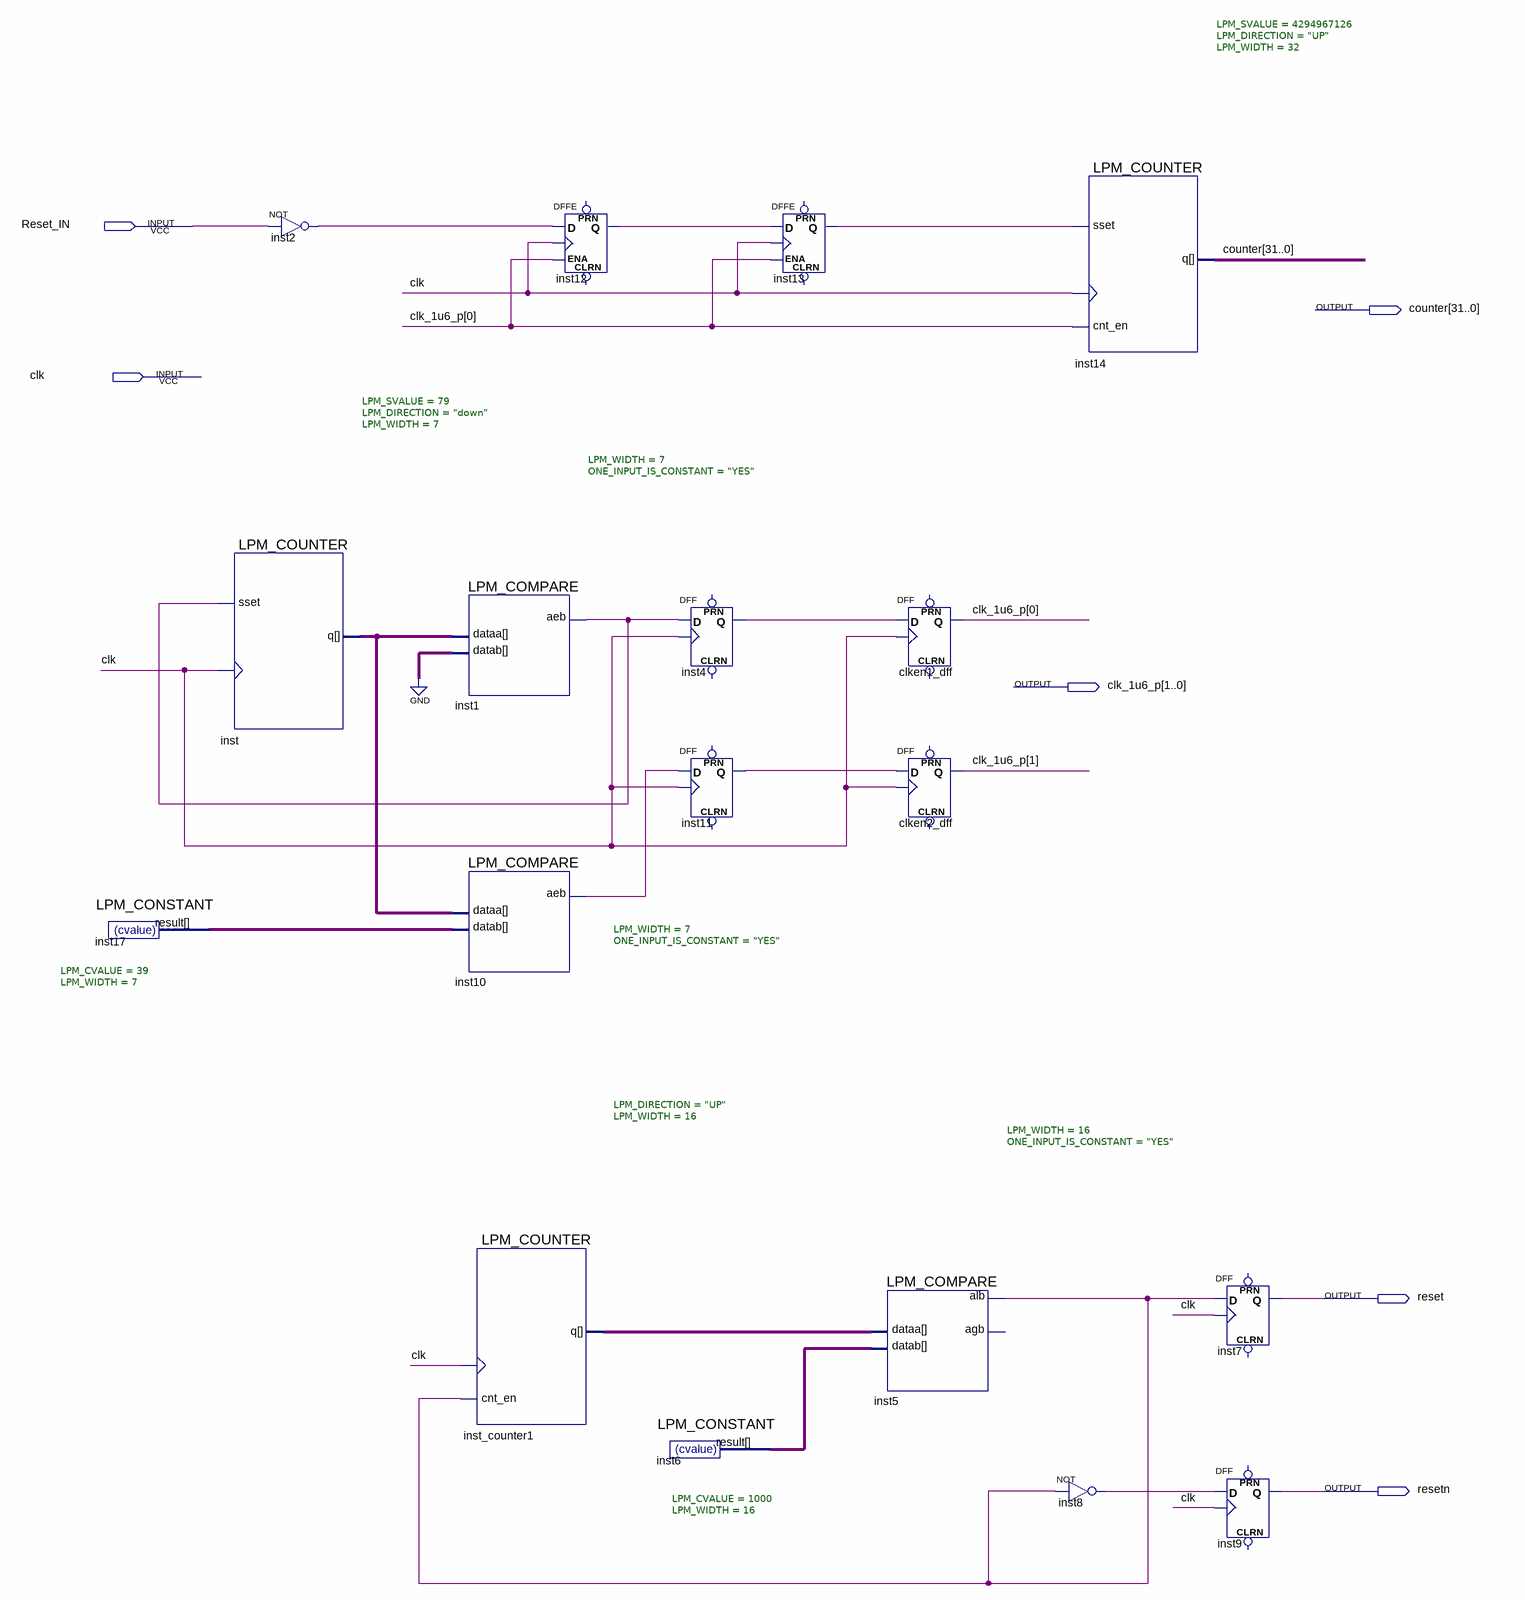
[diagram p0: schematic sheet]
// Quartus schematic CLK_generation.bdf as structural Verilog: 18 symbols, 6 pins
module CLK_generation (
  input  Reset_IN,
  input  clk,
  output [31:0] counter,
  output [1:0] clk_1u6_p,
  output reset,
  output resetn
);

  wire inst1_aeb, inst2_out, inst4_q, inst5_alb, inst8_out, inst10_aeb, inst11_q, inst12_q, inst13_q;
  wire [6:0] inst17_result, inst_q;
  wire [15:0] inst6_result, inst_counter1_q;

  LPM_CONSTANT #(.LPM_CVALUE(39), .LPM_WIDTH(7)) inst17 (.result(inst17_result));
  LPM_COUNTER #(.LPM_SVALUE(79), .LPM_DIRECTION("down"), .LPM_WIDTH(7)) inst (
    .clock(clk), .sset(inst1_aeb), .q(inst_q));
  not inst2 (inst2_out, Reset_IN);
  LPM_COMPARE #(.LPM_WIDTH(7), .ONE_INPUT_IS_CONSTANT("YES")) inst1 (
    .dataa(inst_q), .datab({7{1'b0}}), .aeb(inst1_aeb));
  LPM_COMPARE #(.LPM_WIDTH(7), .ONE_INPUT_IS_CONSTANT("YES")) inst10 (
    .dataa(inst_q), .datab(inst17_result), .aeb(inst10_aeb));
  LPM_COUNTER #(.LPM_DIRECTION("UP"), .LPM_WIDTH(16)) inst_counter1 (
    .clock(clk), .cnt_en(inst5_alb), .q(inst_counter1_q));
  DFFE inst12 (.D(inst2_out), .CLK(clk), .ENA(clk_1u6_p[0]), .Q(inst12_q));  // open: PRN, CLRN
  DFF inst4 (.CLK(clk), .D(inst1_aeb), .Q(inst4_q));  // open: CLRN, PRN
  DFF inst11 (.CLK(clk), .D(inst10_aeb), .Q(inst11_q));  // open: CLRN, PRN
  LPM_CONSTANT #(.LPM_CVALUE(1000), .LPM_WIDTH(16)) inst6 (.result(inst6_result));
  DFFE inst13 (.D(inst12_q), .CLK(clk), .ENA(clk_1u6_p[0]), .Q(inst13_q));  // open: PRN, CLRN
  LPM_COMPARE #(.LPM_WIDTH(16), .ONE_INPUT_IS_CONSTANT("YES")) inst5 (
    .dataa(inst_counter1_q), .datab(inst6_result), .alb(inst5_alb));  // open: agb
  DFF clken1_dff (.CLK(clk), .D(inst4_q), .Q(clk_1u6_p[0]));  // open: CLRN, PRN
  DFF clken2_dff (.CLK(clk), .D(inst11_q), .Q(clk_1u6_p[1]));  // open: CLRN, PRN
  LPM_COUNTER #(.LPM_SVALUE(4294967126), .LPM_DIRECTION("UP"), .LPM_WIDTH(32)) inst14 (
    .clock(clk), .cnt_en(clk_1u6_p[0]), .sset(inst13_q), .q(counter));
  not inst8 (inst8_out, inst5_alb);
  DFF inst7 (.CLK(clk), .D(inst5_alb), .Q(reset));  // open: CLRN, PRN
  DFF inst9 (.CLK(clk), .D(inst8_out), .Q(resetn));  // open: CLRN, PRN
endmodule
